# Altium schematic sheet SingleSupplyAudioAmp.SchDoc
size A3
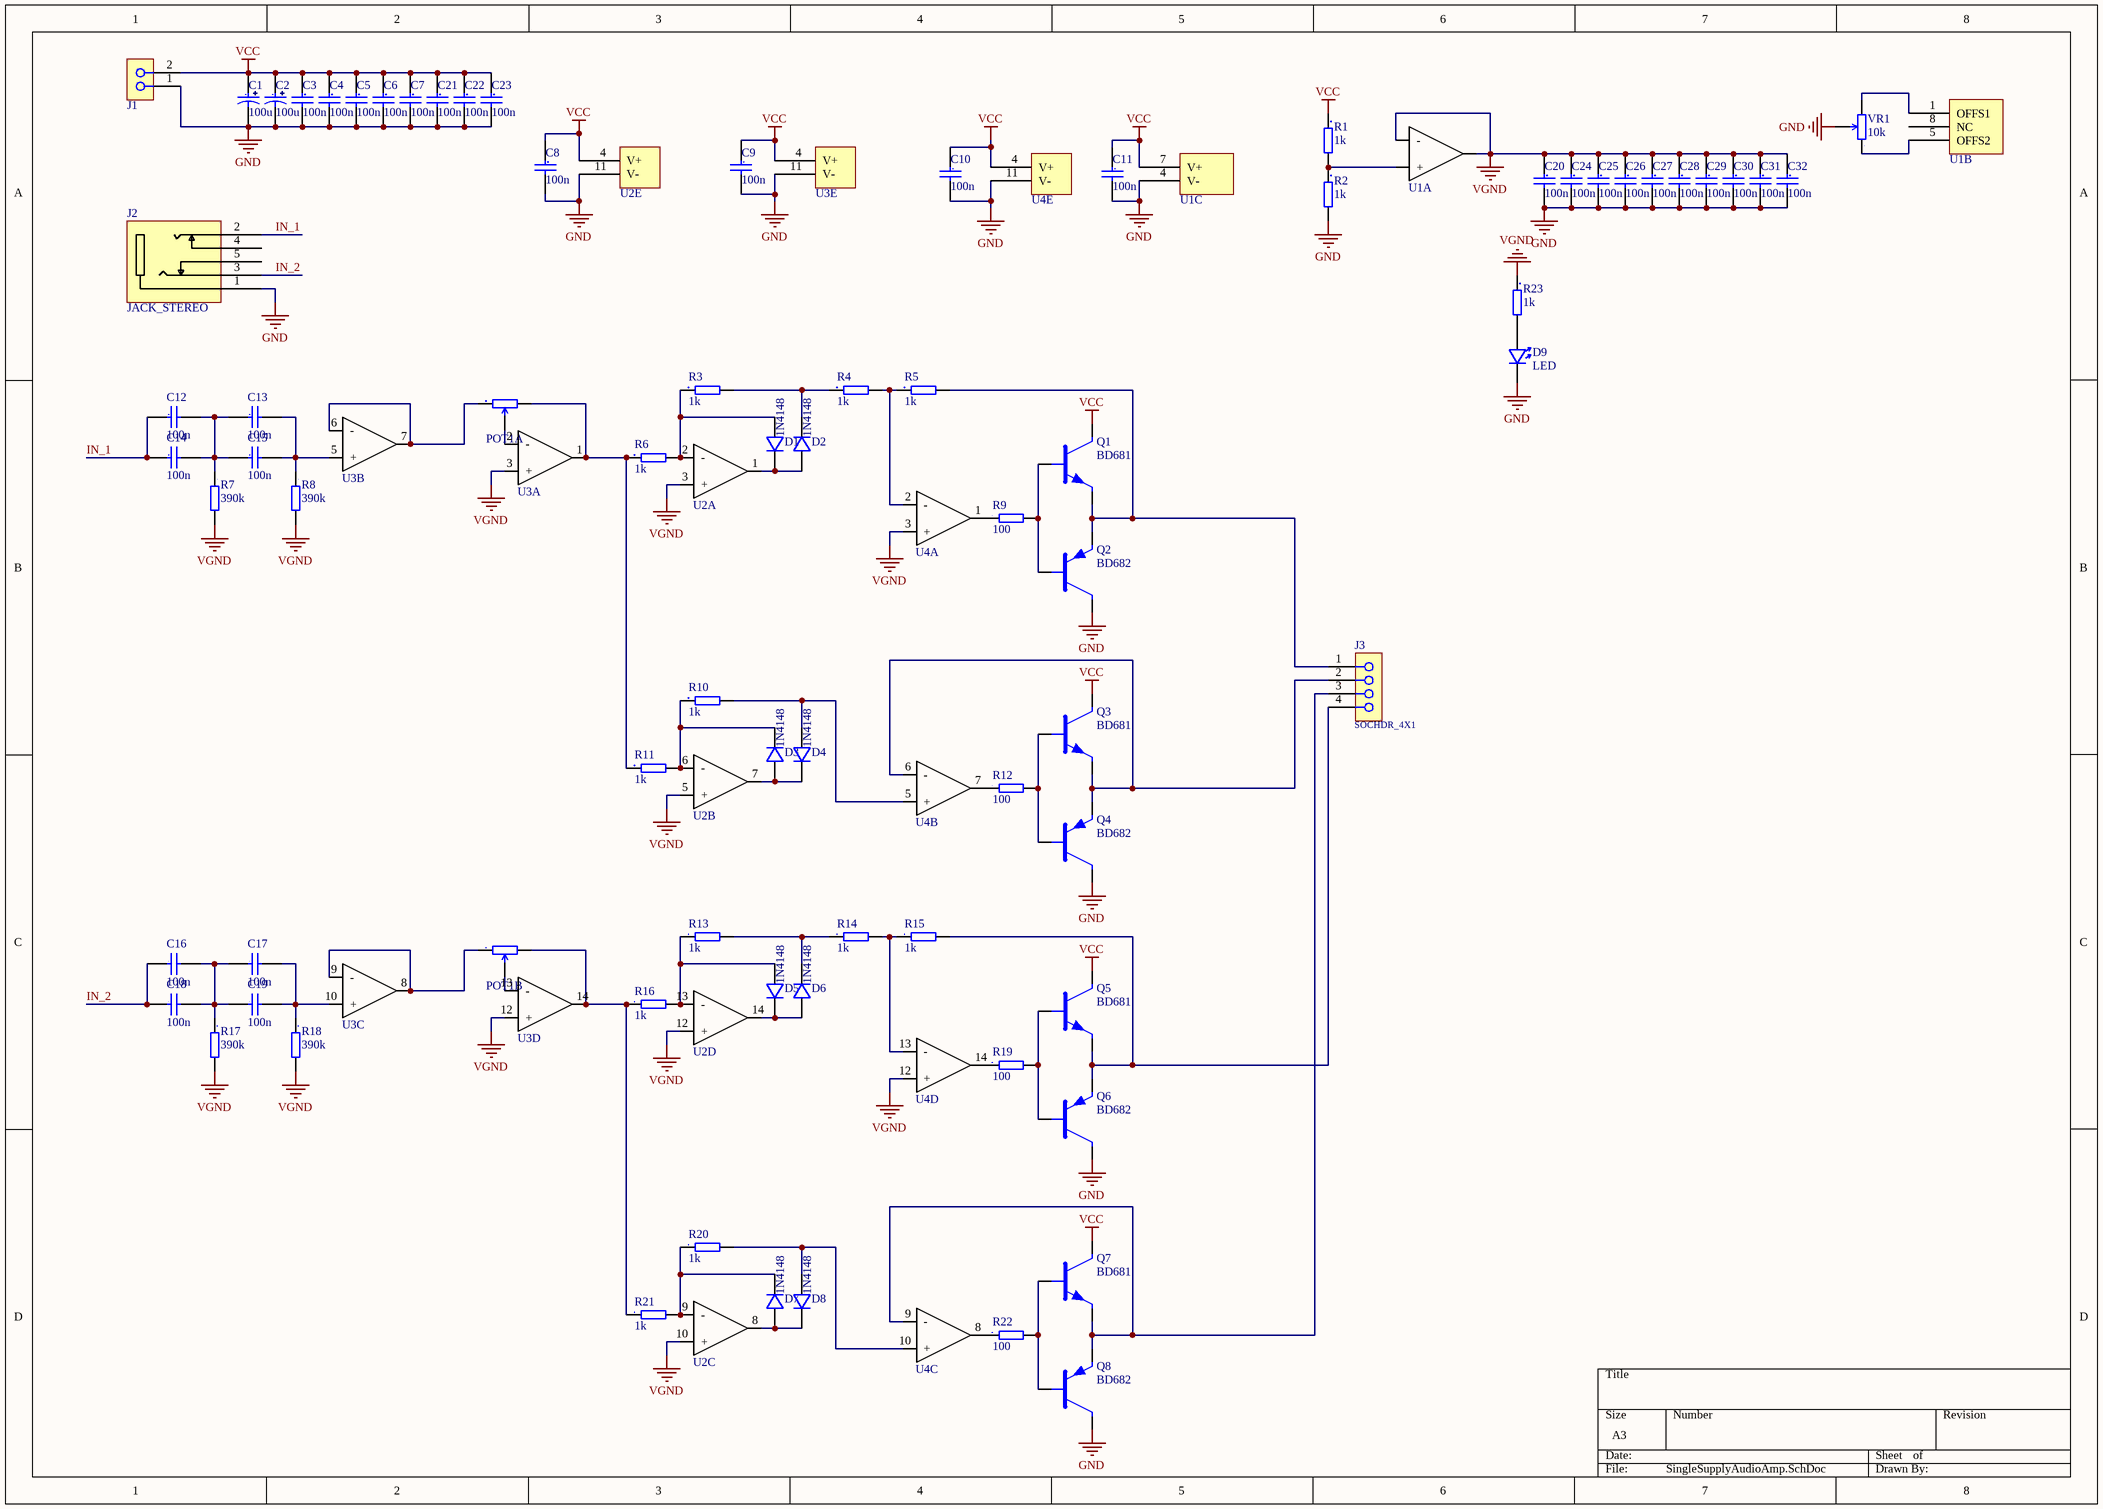
[diagram p0: SingleSupplyAudioAmp.SchDoc]

## Parts
C1  100u  [C_TR3D]
C2  100u  [C_TR3D]
C3  100n  [C0603_N]
C4  100n  [C0603_N]
C5  100n  [C0603_N]
C6  100n  [C0603_N]
C7  100n  [C0603_N]
C8  100n  [C0603_N]
C9  100n  [C0603_N]
C10  100n  [C0603_N]
C11  100n  [C0603_N]
C12  100n  [C0603_N]
C13  100n  [C0603_N]
C14  100n  [C0603_N]
C15  100n  [C0603_N]
C16  100n  [C0603_N]
C17  100n  [C0603_N]
C18  100n  [C0603_N]
C19  100n  [C0603_N]
C20  100n  [C0603_N]
C21  100n  [C0603_N]
C22  100n  [C0603_N]
C23  100n  [C0603_N]
C24  100n  [C0603_N]
C25  100n  [C0603_N]
C26  100n  [C0603_N]
C27  100n  [C0603_N]
C28  100n  [C0603_N]
C29  100n  [C0603_N]
C30  100n  [C0603_N]
C31  100n  [C0603_N]
C32  100n  [C0603_N]
D1  1N4148  [DO-219AB]
D2  1N4148  [DO-219AB]
D3  1N4148  [DO-219AB]
D4  1N4148  [DO-219AB]
D5  1N4148  [DO-219AB]
D6  1N4148  [DO-219AB]
D7  1N4148  [DO-219AB]
D8  1N4148  [DO-219AB]
D9  LED  [LED_0603]
J1  (no value)  [TERM_BLOCK_2x1]
J2  JACK_STEREO  [1503 09]
J3  SOCHDR_4X1  [TERM_BLOCK_4x1]
POT1  RES_POT_S  [POT_STEREO]  (value not drawn)  (parts A,B of 2)
Q1  BD681  [TO-126]
Q2  BD682  [TO-126]
Q3  BD681  [TO-126]
Q4  BD682  [TO-126]
Q5  BD681  [TO-126]
Q6  BD682  [TO-126]
Q7  BD681  [TO-126]
Q8  BD682  [TO-126]
R1  1k  [R0603_N]
R2  1k  [R0603_N]
R3  1k  [R0603_N]
R4  1k  [R0603_N]
R5  1k  [R0603_N]
R6  1k  [R0603_N]
R7  390k  [R0603_N]
R8  390k  [R0603_N]
R9  100  [R0603_N]
R10  1k  [R0603_N]
R11  1k  [R0603_N]
R12  100  [R0603_N]
R13  1k  [R0603_N]
R14  1k  [R0603_N]
R15  1k  [R0603_N]
R16  1k  [R0603_N]
R17  390k  [R0603_N]
R18  390k  [R0603_N]
R19  100  [R0603_N]
R20  1k  [R0603_N]
R21  1k  [R0603_N]
R22  100  [R0603_N]
R23  1k  [R0603_N]
U1  uA741  [SOIC-8]  (value not drawn)  (parts A,B,C of 3)
U2  ADA4610-4  [SOIC-14]  (value not drawn)  (parts A,B,C,D,E of 5)
U3  ADA4610-4  [SOIC-14]  (value not drawn)  (parts A,B,C,D,E of 5)
U4  ADA4610-4  [SOIC-14]  (value not drawn)  (parts A,B,C,D,E of 5)
VR1  10k  [POT_3364W]

## Nets
GND: C1.N C2.N C3.2 C4.2 C5.2 C6.2 C7.2 C8.2 C9.2 C10.2 C11.2 C20.2 C21.2 C22.2 C23.2 C24.2 C25.2 C26.2 C27.2 C28.2 C29.2 C30.2 C31.2 C32.2 D9.K J1.1 J2.1 Q2.C Q4.C Q6.C Q8.C R2.2 U1.4(V-) U2.11(V-) U3.11(V-) U4.11(V-) VR1.WIPER
VCC: C1.P C2.P C3.1 C4.1 C5.1 C6.1 C7.1 C8.1 C9.1 C10.1 C11.1 C21.1 C22.1 C23.1 J1.2 Q1.C Q3.C Q5.C Q7.C R1.1 U1.7(V+) U2.4(V+) U3.4(V+) U4.4(V+)
VGND: C20.1 C24.1 C25.1 C26.1 C27.1 C28.1 C29.1 C30.1 C31.1 C32.1 R7.2 R8.2 R17.2 R18.2 R23.1 U1.2(-) U1.6(Out) U2.3(+) U2.5(+) U2.10(+) U2.12(+) U3.3(+) U3.12(+) U4.3(+) U4.12(+)
IN_1: C12.1 C14.1 J2.2
IN_2: C16.1 C18.1 J2.3
NetC12_2: C12.2 C13.1 C14.2 C15.1 R7.1
NetC13_2: C13.2 C15.2 R8.1 U3.5(+)
NetC16_2: C16.2 C17.1 C18.2 C19.1 R17.1
NetC17_2: C17.2 C19.2 R18.1 U3.10(+)
NetD1_A: D1.A R3.1 R6.2 U2.2(-)
NetD1_C: D1.C D2.A U2.1(Out)
NetD2_C: D2.C R3.2 R4.1
NetD3_A: D3.A D4.C U2.7(Out)
NetD3_C: D3.C R10.1 R11.2 U2.6(-)
NetD4_A: D4.A R10.2 U4.5(+)
NetD5_A: D5.A R13.1 R16.2 U2.13(-)
NetD5_C: D5.C D6.A U2.14(Out)
NetD6_C: D6.C R13.2 R14.1
NetD7_A: D7.A D8.C U2.8(Out)
NetD7_C: D7.C R20.1 R21.2 U2.9(-)
NetD8_A: D8.A R20.2 U4.10(+)
NetD9_A: D9.A R23.2
NetJ3_1: J3.1 Q1.E Q2.E R5.2
NetJ3_2: J3.2 Q3.E Q4.E U4.6(-)
NetJ3_3: J3.3 Q7.E Q8.E U4.9(-)
NetJ3_4: J3.4 Q5.E Q6.E R15.2
NetPOT1_1: POT1.1(CCW) U3.6(-) U3.7(Out)
NetPOT1_2: POT1.2(WIPER) U3.2(-)
NetPOT1_3: POT1.3(CW) R6.1 R11.1 U3.1(Out)
NetPOT1_4: POT1.4(CCW) U3.8(Out) U3.9(-)
NetPOT1_5: POT1.5(WIPER) U3.13(-)
NetPOT1_6: POT1.6(CW) R16.1 R21.1 U3.14(Out)
NetQ1_B: Q1.B Q2.B R9.2
NetQ3_B: Q3.B Q4.B R12.2
NetQ5_B: Q5.B Q6.B R19.2
NetQ7_B: Q7.B Q8.B R22.2
NetR1_2: R1.2 R2.1 U1.3(+)
NetR4_2: R4.2 R5.1 U4.2(-)
NetR9_1: R9.1 U4.1(Out)
NetR12_1: R12.1 U4.7(Out)
NetR14_2: R14.2 R15.1 U4.13(-)
NetR19_1: R19.1 U4.14(Out)
NetR22_1: R22.1 U4.8(Out)
NetU1_1: U1.1(OFFS1) VR1.CW
NetU1_5: U1.5(OFFS2) VR1.CCW

Not connected (* = marked no-connect by the designer): J2 4 5; U1 8(NC)

## Library data of the parts
C1 C2 = CAP_POL: RevS: $Rev:: 58        $
C3-C32 = CAP: RevS: $Rev:: 58        $
D1-D8 = DIODE
J1 = SOCHDR_2X1: Socket; ComponentLink1Description: Manufacturer; ComponentLink1URL: http://www.we-online.de; ComponentLink2Description: Datasheet; ComponentLink2URL: http://katalog.we-online.de/em/datasheet/691412320002.pdf
J2 = JACK_STEREO: 3,5mm Stereo Jack connector, Lumberg 1503 09 type
J3 = SOCHDR_4X1: Socket; ComponentLink1Description: Manufacturer; ComponentLink1URL: http://www.we-online.de; ComponentLink2Description: Datasheet; ComponentLink2URL: http://katalog.we-online.de/em/datasheet/691412320002.pdf
POT1 = RES_POT_S: Stereo
Q1 Q3 Q5 Q7 = BJT_NPN
Q2 Q4 Q6 Q8 = BJT_PNP
R1-R23 = RES
U1 = uA741: Rail-to-Rail, 90uV Vos, Precision op. amp.
U2-U4 = ADA4610-4: Dual op. amp., Rail-to-Rail
VR1 = RES_POT_M: Mono; pin to pad: CCW>1 CW>3 WIPER>2